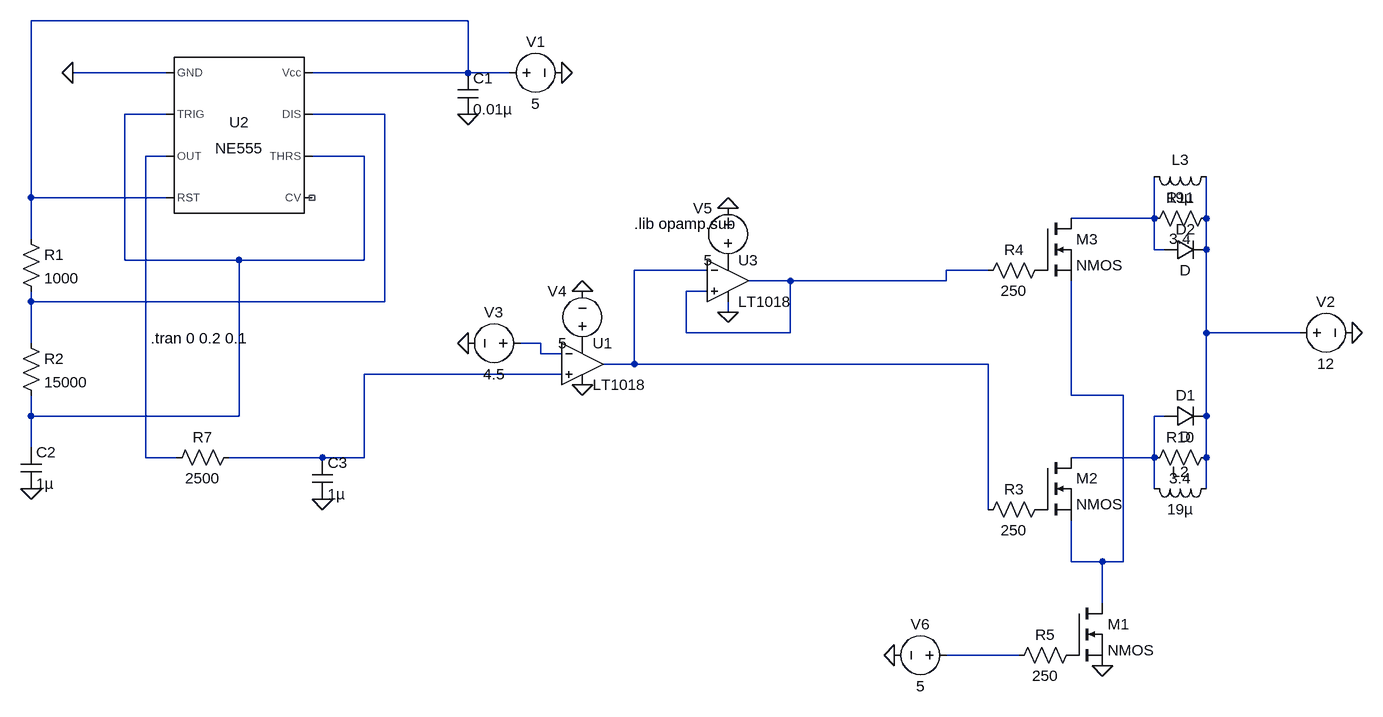
[diagram p0: schematic motorstyring.asc]
motorstyring.asc, the LTspice schematic file:
Version 4
SHEET 1 1380 1136
WIRE 0 80 -672 80
WIRE -464 160 -608 160
WIRE 0 160 0 80
WIRE 0 160 -240 160
WIRE 64 160 0 160
WIRE -464 224 -528 224
WIRE -128 224 -240 224
WIRE -464 288 -496 288
WIRE -160 288 -240 288
WIRE -672 352 -672 80
WIRE -464 352 -672 352
WIRE 1056 384 1056 320
WIRE 1056 384 928 384
WIRE 1136 384 1136 320
WIRE -672 416 -672 352
WIRE 1056 432 1056 384
WIRE 1072 432 1056 432
WIRE 1136 432 1136 384
WIRE -528 448 -528 224
WIRE -352 448 -528 448
WIRE -160 448 -160 288
WIRE -160 448 -352 448
WIRE 368 464 256 464
WIRE 800 464 736 464
WIRE 496 480 432 480
WIRE 736 480 736 464
WIRE 736 480 496 480
WIRE 368 496 336 496
WIRE -672 512 -672 496
WIRE -128 512 -128 224
WIRE -128 512 -672 512
WIRE 400 528 400 512
WIRE 336 560 336 496
WIRE 496 560 496 480
WIRE 496 560 336 560
WIRE 1136 560 1136 432
WIRE 1280 560 1136 560
WIRE -672 576 -672 512
WIRE 112 576 80 576
WIRE 112 592 112 576
WIRE 144 592 112 592
WIRE 256 608 256 464
WIRE 256 608 208 608
WIRE 800 608 256 608
WIRE 144 624 -160 624
WIRE 928 656 928 480
WIRE 1008 656 928 656
WIRE -672 688 -672 656
WIRE -352 688 -352 448
WIRE -352 688 -672 688
WIRE 1072 688 1056 688
WIRE 1136 688 1136 560
WIRE -672 736 -672 688
WIRE -496 752 -496 288
WIRE -448 752 -496 752
WIRE -224 752 -368 752
WIRE -160 752 -160 624
WIRE -160 752 -224 752
WIRE 1056 752 1056 688
WIRE 1056 752 928 752
WIRE 1136 752 1136 688
WIRE 1056 800 1056 752
WIRE 1136 800 1136 752
WIRE 800 832 800 608
WIRE 928 912 928 848
WIRE 976 912 928 912
WIRE 1008 912 1008 656
WIRE 1008 912 976 912
WIRE 976 976 976 912
WIRE 848 1056 736 1056
FLAG 176 640 0
FLAG 176 496 0
FLAG 0 576 0
FLAG 400 368 0
FLAG 400 528 0
FLAG 144 160 0
FLAG -608 160 0
FLAG 0 224 0
FLAG -672 800 0
FLAG -224 816 0
FLAG 1360 560 0
FLAG 976 1072 0
FLAG 656 1056 0
SYMBOL Comparators\\LT1018 176 608 R0
SYMATTR InstName U1
SYMBOL voltage 176 592 R180
WINDOW 0 24 96 Left 2
WINDOW 3 24 16 Left 2
WINDOW 123 0 0 Left 0
WINDOW 39 0 0 Left 0
SYMATTR InstName V4
SYMATTR Value 5
SYMBOL voltage 96 576 R90
WINDOW 0 -32 56 VBottom 2
WINDOW 3 32 56 VTop 2
WINDOW 123 0 0 Left 0
WINDOW 39 0 0 Left 0
SYMATTR InstName V3
SYMATTR Value 4.5
SYMBOL voltage 400 464 R180
WINDOW 0 24 96 Left 2
WINDOW 3 24 16 Left 2
WINDOW 123 0 0 Left 0
WINDOW 39 0 0 Left 0
SYMATTR InstName V5
SYMATTR Value 5
SYMBOL Misc\\NE555 -352 256 R0
SYMATTR InstName U2
SYMBOL voltage 48 160 R270
WINDOW 0 32 56 VTop 2
WINDOW 3 -32 56 VBottom 2
WINDOW 123 0 0 Left 0
WINDOW 39 0 0 Left 0
SYMATTR InstName V1
SYMATTR Value 5
SYMBOL cap -16 160 R0
SYMATTR InstName C1
SYMATTR Value 0.01µ
SYMBOL res -688 400 R0
SYMATTR InstName R1
SYMATTR Value 1000
SYMBOL res -688 560 R0
SYMATTR InstName R2
SYMATTR Value 15000
SYMBOL cap -688 736 R0
SYMATTR InstName C2
SYMATTR Value 1µ
SYMBOL res -352 736 R90
WINDOW 0 0 56 VBottom 2
WINDOW 3 32 56 VTop 2
SYMATTR InstName R7
SYMATTR Value 2500
SYMBOL cap -240 752 R0
SYMATTR InstName C3
SYMATTR Value 1µ
SYMBOL nmos 880 752 R0
SYMATTR InstName M2
SYMBOL Comparators\\LT1018 400 480 R0
SYMATTR InstName U3
SYMBOL nmos 880 384 R0
SYMATTR InstName M3
SYMBOL res 1152 736 R90
WINDOW 0 0 56 VBottom 2
WINDOW 3 32 56 VTop 2
SYMATTR InstName R10
SYMATTR Value 3.4
SYMBOL res 1152 368 R90
WINDOW 0 0 56 VBottom 2
WINDOW 3 32 56 VTop 2
SYMATTR InstName R11
SYMATTR Value 3.4
SYMBOL ind 1152 784 R90
WINDOW 0 5 56 VBottom 2
WINDOW 3 32 56 VTop 2
SYMATTR InstName L2
SYMATTR Value 19µ
SYMBOL ind 1152 304 R90
WINDOW 0 5 56 VBottom 2
WINDOW 3 32 56 VTop 2
SYMATTR InstName L3
SYMATTR Value 19µ
SYMBOL voltage 1264 560 R270
WINDOW 0 32 56 VTop 2
WINDOW 3 -32 56 VBottom 2
WINDOW 123 0 0 Left 0
WINDOW 39 0 0 Left 0
SYMATTR InstName V2
SYMATTR Value 12
SYMBOL diode 1072 704 R270
WINDOW 0 32 32 VTop 2
WINDOW 3 0 32 VBottom 2
SYMATTR InstName D1
SYMBOL diode 1072 448 R270
WINDOW 0 32 32 VTop 2
WINDOW 3 0 32 VBottom 2
SYMATTR InstName D2
SYMBOL res 896 816 R90
WINDOW 0 0 56 VBottom 2
WINDOW 3 32 56 VTop 2
SYMATTR InstName R3
SYMATTR Value 250
SYMBOL res 896 448 R90
WINDOW 0 0 56 VBottom 2
WINDOW 3 32 56 VTop 2
SYMATTR InstName R4
SYMATTR Value 250
SYMBOL nmos 928 976 R0
SYMATTR InstName M1
SYMBOL voltage 752 1056 R90
WINDOW 0 -32 56 VBottom 2
WINDOW 3 32 56 VTop 2
WINDOW 123 0 0 Left 0
WINDOW 39 0 0 Left 0
SYMATTR InstName V6
SYMATTR Value 5
SYMBOL res 944 1040 R90
WINDOW 0 0 56 VBottom 2
WINDOW 3 32 56 VTop 2
SYMATTR InstName R5
SYMATTR Value 250
TEXT -488 568 Left 2 !.tran 0 0.2 0.1
TEXT 256 392 Left 2 !.lib opamp.sub

The netlist it stands for:
* motorstyring.asc
XU1 N010 N009 P001 0 N007 LT1018  ; pins In+ In- V+ V- OUT
V4 P001 0 5
V3 N009 0 4.5
V5 P002 0 5
XU2 0 N002 N004 N001 NC_01 N002 N003 N001 NE555  ; pins GND TRIG OUT RST CV THRS DIS Vcc
V1 N001 0 5
C1 N001 0 0.01µ
R1 N001 N003 1000
R2 N003 N002 15000
C2 N002 0 1µ
R7 N010 N004 2500
C3 N010 0 1µ
M2 N012 P003 N011 N011 NMOS
XU3 N008 N007 P002 0 N008 LT1018  ; pins In+ In- V+ V- OUT
M3 N005 P004 N011 N011 NMOS
R10 N006 N012 3.4
R11 N006 N005 3.4
L2 N006 N012 19µ
L3 N006 N005 19µ
V2 N006 0 12
D1 N012 N006 D
D2 N005 N006 D
R3 P003 N007 250
R4 P004 N008 250
M1 N011 P005 0 0 NMOS
V6 N013 0 5
R5 P005 N013 250
.model D D
.lib standard.dio
.model NMOS NMOS
.model PMOS PMOS
.lib standard.mos
.tran 0 0.2 0.1
.lib opamp.sub
.lib LTC1.lib
.lib NE555.sub
.backanno
.end